# EAGLE schematic I2S ESP32 (EAGLE 9.6.2)
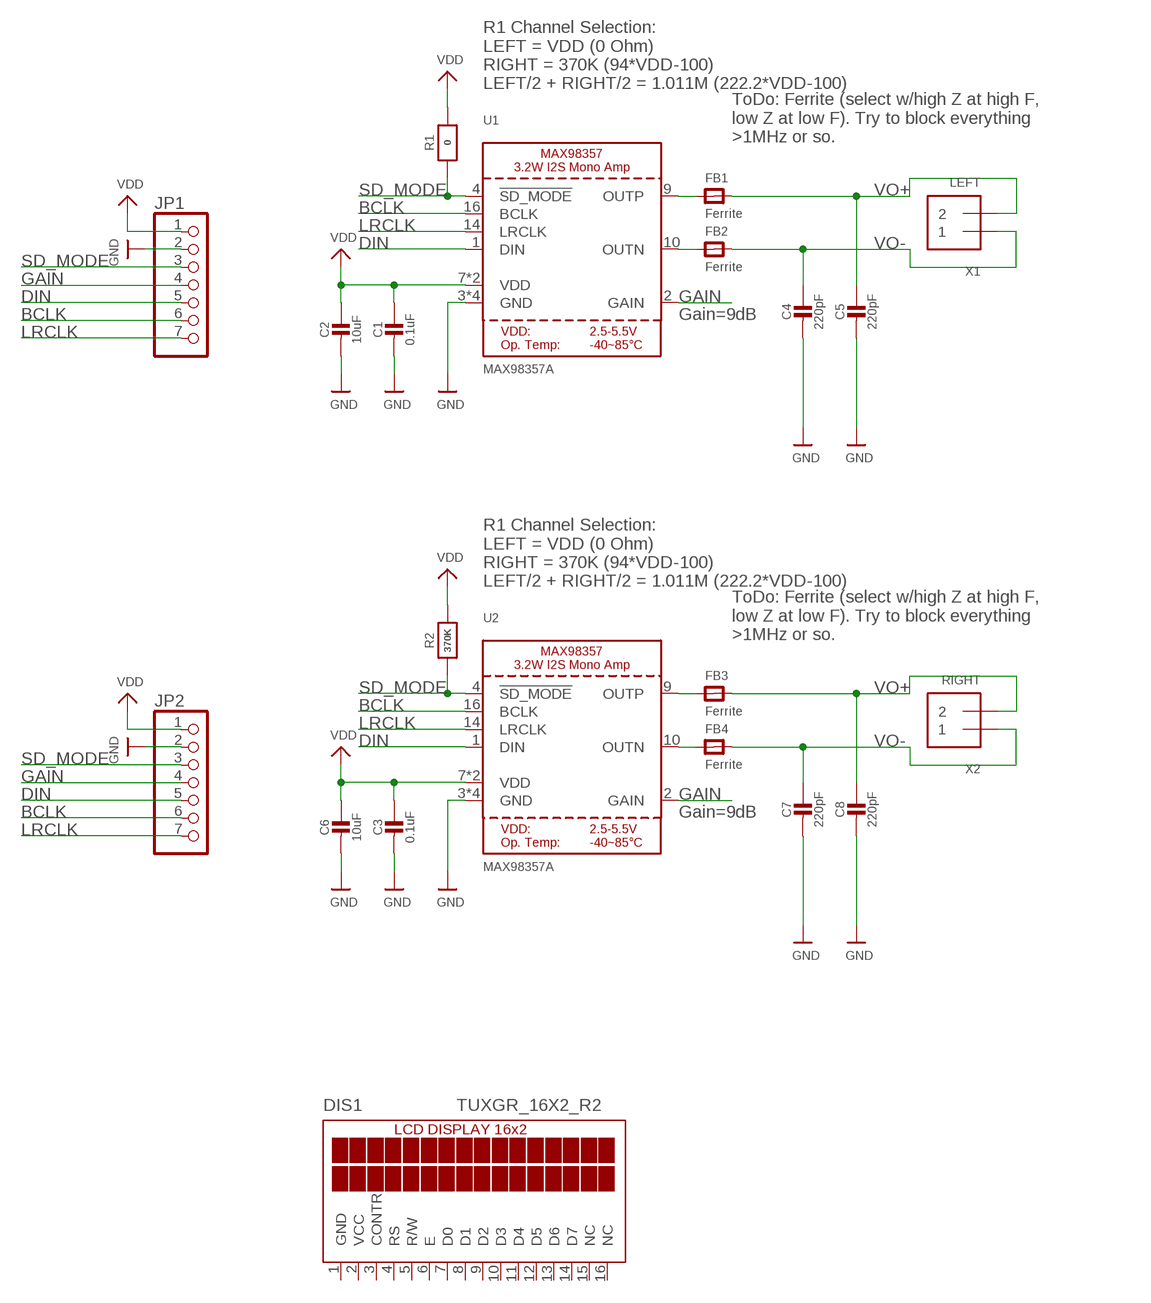
[diagram p0: schematic, sheet 1]

## Parts
C1  0.1uF  CAP_CERAMIC0805-NOOUTLINE  [0805-NO]
C2  10uF  CAP_CERAMIC0805-NOOUTLINE  [0805-NO]
C3  0.1uF  CAP_CERAMIC0805-NOOUTLINE  [0805-NO]
C4  220pF  CAP_CERAMIC0805-NOOUTLINE  [0805-NO]
C5  220pF  CAP_CERAMIC0805-NOOUTLINE  [0805-NO]
C6  10uF  CAP_CERAMIC0805-NOOUTLINE  [0805-NO]
C7  220pF  CAP_CERAMIC0805-NOOUTLINE  [0805-NO]
C8  220pF  CAP_CERAMIC0805-NOOUTLINE  [0805-NO]
DIS1  TUXGR_16X2_R2  [TUXGR_16X2_R2]
FB1  Ferrite  FERRITE-0805NO  [0805-NO]
FB2  Ferrite  FERRITE-0805NO  [0805-NO]
FB3  Ferrite  FERRITE-0805NO  [0805-NO]
FB4  Ferrite  FERRITE-0805NO  [0805-NO]
JP1  HEADER-1X7THICKER  [1X07_ROUND_76]
JP2  HEADER-1X7THICKER  [1X07_ROUND_76]
R1  0  RESISTOR0805_NOOUTLINE  [0805-NO]
R2  370K  RESISTOR0805_NOOUTLINE  [0805-NO]
U1  MAX98357A  AUDIOAMP_MAX98357  [QFN16_3MM]
U2  MAX98357A  AUDIOAMP_MAX98357  [QFN16_3MM]
X1  LEFT  TERMBLOCK_1X2  [TERMBLOCK_1X2-3.5MM]
X2  RIGHT  TERMBLOCK_1X2  [TERMBLOCK_1X2-3.5MM]

## Nets
BCLK: JP1.6 JP2.6 U1.16(BCLK) U2.16(BCLK)
DIN: JP1.5 JP2.5 U1.1(DIN) U2.1(DIN)
GAIN: JP1.4 JP2.4 U1.2(GAIN) U2.2(GAIN)
GND: C1.2 C2.2 C3.2 C4.2 C5.2 C6.2 C7.2 C8.2 JP1.2 JP2.2 U1.3(GND) U1.11(GND) U1.15(GND) U1.THERMAL(GND) U2.3(GND) U2.11(GND) U2.15(GND) U2.THERMAL(GND)
LRCLK: JP1.7 JP2.7 U1.14(LRCLK) U2.14(LRCLK)
N$1: FB4.1 U2.10(OUTN)
N$2: FB3.1 U2.9(OUTP)
N$5: FB2.1 U1.10(OUTN)
N$6: FB1.1 U1.9(OUTP)
SD_MODE: JP1.3 JP2.3 R1.1 R2.1 U1.4(!SD_MODE) U2.4(!SD_MODE)
VDD: C1.1 C2.1 C3.1 C6.1 JP1.1 JP2.1 R1.2 R2.2 U1.7(VDD) U1.8(VDD) U2.7(VDD) U2.8(VDD)
VO+: C5.1 C8.1 FB1.2 FB3.2 X1.2 X2.2
VO-: C4.1 C7.1 FB2.2 FB4.2 X1.1 X2.1
Unconnected: DIS1.3(CONTR) DIS1.4(RS) DIS1.5(R/W) DIS1.6(E) DIS1.7(D0) DIS1.8(D1) DIS1.9(D2) DIS1.10(D3) DIS1.11(D4) DIS1.12(D5) DIS1.13(D6) DIS1.14(D7) DIS1.15(NC) DIS1.16(NC)

## Notes on the sheet
- R1 Channel Selection:
  LEFT = VDD (0 Ohm)
  RIGHT = 370K (94*VDD-100)
  LEFT/2 + RIGHT/2 = 1.011M (222.2*VDD-100)
- ToDo: Ferrite (select w/high Z at high F,
  low Z at low F). Try to block everything
  >1MHz or so.
- Gain=9dB
- R1 Channel Selection:
  LEFT = VDD (0 Ohm)
  RIGHT = 370K (94*VDD-100)
  LEFT/2 + RIGHT/2 = 1.011M (222.2*VDD-100)
- ToDo: Ferrite (select w/high Z at high F,
  low Z at low F). Try to block everything
  >1MHz or so.
- Gain=9dB

## Power pins joined to a net without a drawn wire
GND: DIS1.1(GND)
VCC: DIS1.2(VCC)

## Library data of the parts
C1-C8 = microbuilder:CAP_CERAMIC: Ceramic Capacitors For new designs, use the packages preceded by an '_' character since they are more reliable: The following footprints should be used on most boards: _0402 - Standard footprint for regular board layouts _0603 - Standard footprint for regular board layouts _0805 - Standard footprint for regular board layouts _1206 - Standard footprint for regular board layouts For extremely tight-pitch boards where space is at a premium, the following 'micro-pitch' footprints can be used (smaller pads, no silkscreen outline, etc.): _0402MP - Micro-pitch footprint for very dense/compact boards _0603MP - Micro-pitch footprint for very dense/compact boards _0805MP - Micro-pitch footprint for very dense/compact boards _1206MP - Micro-pitch footprint for very dense/compact boards
DIS1 = display-lcd:TUXGR_16X2_R2: Tuxgraphics LCD display 16x2 characters reflective, without background light Source: tuxgr_12x2_r2.pdf; OC_FARNELL: unknown; OC_NEWARK: unknown
FB1-FB4 = microbuilder:FERRITE: Ferrite Bead 0603 MMZ1608B121C - 120 Ohm @ 100MHz, 600mA, 0.15 Ohm DC Resistance - Digikey: 445-2164-1-ND BK1608HW121-T - 120 Ohm, 600mA Ferrite Chip - Digikey: 587-1876-2-ND 0805 HZ0805B272R-10 - 2.7K Ohm @ 100MHz, 200mA, 0.8 Ohm DC Resistance - Digikey: 240-2504-1-ND (see also Murata BLM21BD272SN1L) MMZ2012Y152B - 1.5K Ohm @ 100MHz, 500mA, 0.4 Ohm DC Resistance - Digikey: 445-1560-1-ND - Mainly for high frequency (80-400MHz) MMZ2012R102A - 1K Ohm @ 100MHz, 500mA, 0.3 Ohm DC Resistance - Digikey: 445-1555-2-ND - More general purpose (10-200MHz)
JP1 JP2 = microbuilder:HEADER-1X7: PIN HEADER
R1 R2 = microbuilder:RESISTOR: Resistors For new designs, use the packages preceded by an '_' character since they are more reliable: The following footprints should be used on most boards: _0402 - Standard footprint for regular board layouts _0603 - Standard footprint for regular board layouts _0805 - Standard footprint for regular board layouts _1206 - Standard footprint for regular board layouts For extremely tight-pitch boards where space is at a premium, the following 'micro-pitch' footprints can be used (smaller pads, no silkscreen outline, etc.): _0402MP - Micro-pitch footprint for very dense/compact boards _0603MP - Micro-pitch footprint for very dense/compact boards _0805MP - Micro-pitch footprint for very dense/compact boards _1206MP - Micro-pitch footprint for very dense/compact boards
U1 U2 = microbuilder:AUDIOAMP_MAX98357: MAX98357 - 3.2W I2S Mono Audio Amp
X1 X2 = microbuilder:TERMBLOCK_1X2: 3.5mm Terminal block http://www.ladyada.net/library/pcb/eaglelibrary.html